# EAGLE design Open Playback Recorder Top (EAGLE 9.6.2)
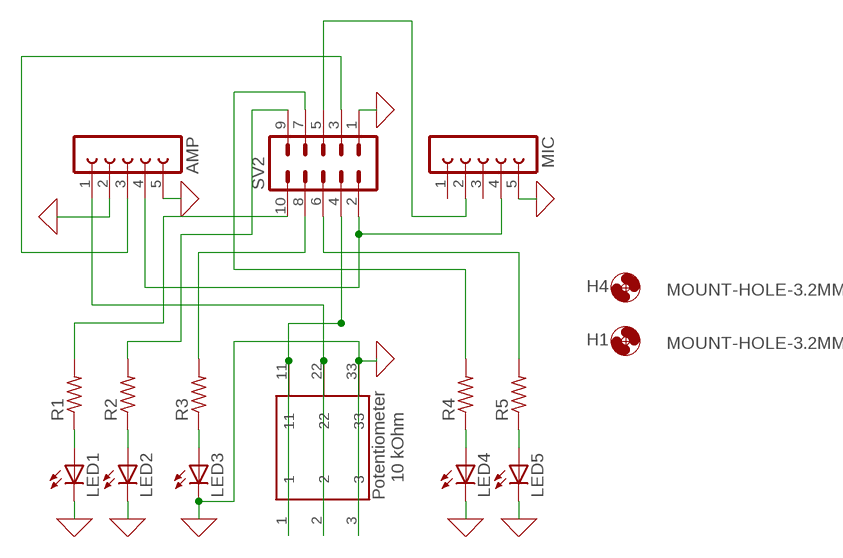
[diagram p0: schematic, sheet 1]

## Parts
AMP  FE05-1  [FE05-1]
H1  MOUNT-HOLE-3.2MM  [HOLE-3.2MM]
H4  MOUNT-HOLE-3.2MM  [HOLE-3.2MM]
LED1  LED5MM  [LED5MM]
LED2  LED5MM  [LED5MM]
LED3  LED5MM  [LED5MM]
LED4  LED5MM  [LED5MM]
LED5  LED5MM  [LED5MM]
MIC  FE05-1  [FE05-1]
R1  RESISTOR-US-0206/80206/8  [RESISTOR_0206/8]
R2  RESISTOR-US-0206/80206/8  [RESISTOR_0206/8]
R3  RESISTOR-US-0206/80206/8  [RESISTOR_0206/8]
R4  RESISTOR-US-0206/80206/8  [RESISTOR_0206/8]
R5  RESISTOR-US-0206/80206/8  [RESISTOR_0206/8]
SV2  MA05-2  [MA05-2]
U$2  POTENTIOMETER  [POTENTIOMETER]

## Nets
GND: AMP.2 AMP.5 LED1.K(C) LED2.K(C) LED3.K(C) LED4.K(C) LED5.K(C) MIC.5 SV2.1 U$2.3 U$2.33
N$1: LED1.A R1.1
N$2: LED2.A R2.1
N$3: LED3.A R3.1
N$4: LED4.A R4.1
N$5: LED5.A R5.1
N$6: SV2.4 U$2.1 U$2.11
N$8: AMP.4 MIC.4 SV2.2
N$9: AMP.1 U$2.2 U$2.22
N$11: R1.2 SV2.10
N$12: R2.2 SV2.9
N$13: R3.2 SV2.8
N$14: R4.2 SV2.7
N$16: R5.2 SV2.6
N$17: MIC.2 SV2.5
N$18: AMP.3 SV2.3
Unconnected: MIC.1 MIC.3

## Library data of the parts
AMP MIC = con-lsta:FE05-1: FEMALE HEADER; OC_FARNELL: unknown; OC_NEWARK: unknown
H1 H4 = MMC Eagle:MOUNT-HOLE-: MOUNTING HOLE with drill center marker
LED1-LED5 = adafruit:LED: LED OSRAM: - CHIPLED LG R971, LG N971, LY N971, LG Q971, LY Q971, LO R971, LY R971 LH N974, LH R974 LS Q976, LO Q976, LY Q976 LO Q996 - Hyper CHIPLED LW Q18S LB Q993, LB Q99A, LB R99A - SideLED LS A670, LO A670, LY A670, LG A670, LP A670 LB A673, LV A673, LT A673, LW A673 LH A674 LY A675 LS A676, LA A676, LO A676, LY A676, LW A676 LS A679, LY A679, LG A679 - Hyper Micro SIDELED® LS Y876, LA Y876, LO Y876, LY Y876 LT Y87S - SmartLED LW L88C, LW L88S LB L89C, LB L89S, LG L890 LS L89K, LO L89K, LY L89K LS L896, LA L896, LO L896, LY L896 - TOPLED LS T670, LO T670, LY T670, LG T670, LP T670 LSG T670, LSP T670, LSY T670, LOP T670, LYG T670 LG T671, LOG T671, LSG T671 LB T673, LV T673, LT T673, LW T673 LH T674 LS T676, LA T676, LO T676, LY T676, LB T676, LH T676, LSB T676, LW T676 LB T67C, LV T67C, LT T67C, LS T67K, LO T67K, LY T67K, LW E67C LS E67B, LA E67B, LO E67B, LY E67B, LB E67C, LV E67C, LT E67C LW T67C LS T679, LY T679, LG T679 LS T770, LO T770, LY T770, LG T770, LP T770 LB T773, LV T773, LT T773, LW T773 LH T774 LS E675, LA E675, LY E675, LS T675 LS T776, LA T776, LO T776, LY T776, LB T776 LHGB T686 LT T68C, LB T68C - Hyper Mini TOPLED® LB M676 - Mini TOPLED Santana® LG M470 LS M47K, LO M47K, LY M47K Source: http://www.osram.convergy.de/
R1-R5 = MMC_Eagle:RESISTOR-US-: RESISTOR, American symbol
SV2 = con-lstb:MA05-2: PIN HEADER; OC_FARNELL: unknown; OC_NEWARK: unknown
U$2 = OPR:POTENTIOMETER

## Board
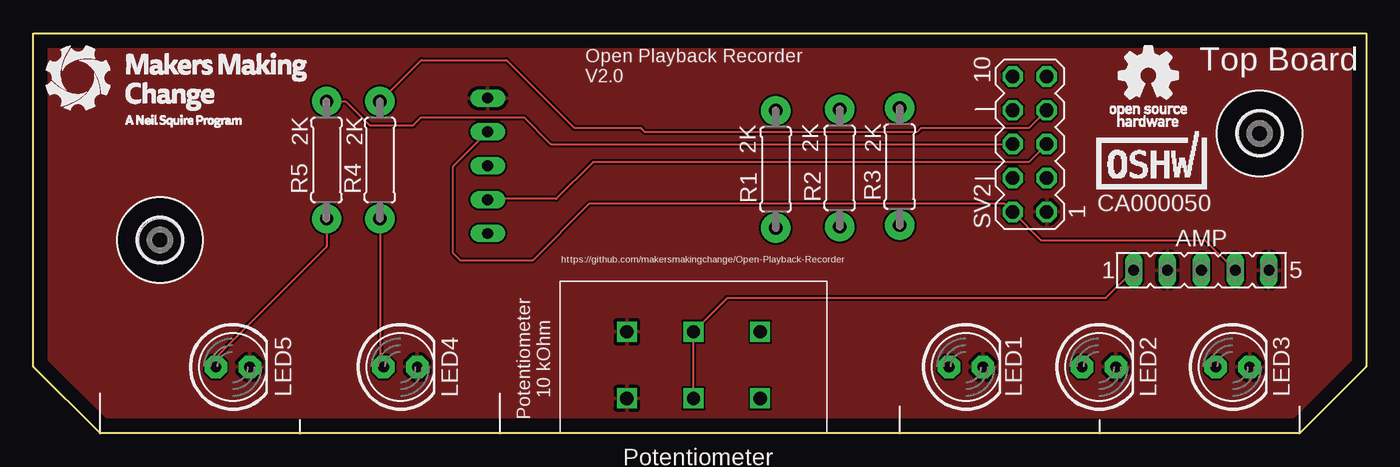
[diagram p1: board, top side]
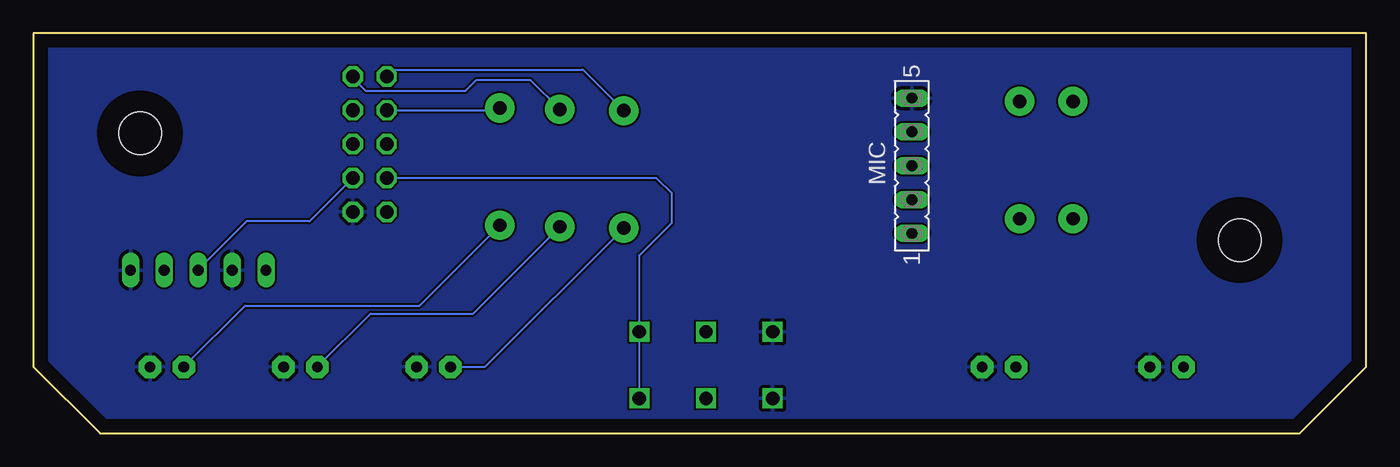
[diagram p2: board, bottom side, seen from below]

Size 100 x 30 mm. Coordinates in mm from the lower left corner, seen from the top.
Outline: 5,0 0,5 0,30 100,30 100,5 95,0 5,0
Copper layers (1*16): Top 0.035mm / dielectric 1.5mm / Bottom 0.035mm
Design rules "default": minimum track width 6mil, minimum drill 0.35mm, track to track 6mil, track to pad 6mil, pad to pad 6mil, via to via 6mil, smd to smd 6mil, copper to edge 40mil, drill to drill 6mil, minimum pad ring 10mil, minimum via ring 8mil, stop-mask expansion 4mil, vias tented up to drill 0mil, thermal gap 10mil

### Footprints (pad centres in the part's own frame; a part is rotated, then mirrored left to right if it is on the bottom)
FE05-1 = drill 0.813 long: 1 -5.08,0; 2 -2.54,0; 3 0,0; 4 2.54,0; 5 5.08,0
HOLE-3.2MM = hole 3.2: 0,0
LED5MM = drill 0.813 pad 1.676 octagon: A -1.27,0; K 1.27,0
RESISTOR_0206/8 = drill 1 pad 2.184: 1 -4.4,0; 2 4.4,0
MA05-2 = drill 1.016 octagon: 1 -5.08,-1.27; 2 -5.08,1.27; 3 -2.54,-1.27; 4 -2.54,1.27; 5 0,-1.27; 6 0,1.27; 7 2.54,-1.27; 8 2.54,1.27; 9 5.08,-1.27; 10 5.08,1.27
POTENTIOMETER = drill 1 square: 1 0,10; 2 0,5; 3 0,0; 11 5,10; 22 5,5; 33 5,0

### Placement (x,y rotation side)
AMP  87.63,12.24 0 top
H1  92,22.5 0 top
H4  9.5,14.5 0 top
LED1  69.97,4.98 0 top
LED2  79.96,4.98 0 top
LED3  89.98,4.98 0 top
LED4  27.54,4.98 0 top
LED5  14.97,4.98 0 top
MIC  34.09,20.07 90 bottom
R1  55.7,19.8 90 top
R2  60.5,19.9 90 top
R3  65,20 90 top
R4  26,20.5 90 top
R5  22,20.5 90 top
SV2  74.76,21.69 90 top
U$1  [MMC_SMALL_LOGO]  12,26 0 top
U$2  44.53,7.62 270 top
U$3  [OSHW_X-SMALL_LOGO]  83.6,26 0 top
U$4  CA000050  [OSHWA-CERT-SMALL-SILK]  83.9,18.3 0 top

### Tracks (layer width: path | path; a pad name or v marks a point on that pad's centre or on a via)
GND
  pour Bottom: 0,30 0,5 5,0 95,0 100,5 100,30
  pour Top: 0,30 0,5 5,0 95,0 100,5 100,30
  pour Top: 95,0 5,0 0,5 0,30 100,30 100,5
  pour Bottom: 5,0 0,5 0,30 100,30 100,5 95,0
N$1
  Bottom 0.152: LED1.A 66.12,4.98 R1.1
N$2
  Bottom 0.152: LED2.A 74.69,8.98 67.02,8.98 R2.1
N$3
  Bottom 0.152: R3.1 71.02,9.58 84.11,9.58 LED3.A
N$4
  Top 0.152: R4.1 26,5.25 LED4.A
N$5
  Top 0.152: R5.1 22,14 13.7,5.7 LED5.A
N$6
  Bottom 0.152: U$2.11 U$2.1 54.53,13.37 52.1,15.8 52.1,18 53.25,19.15 SV2.4
N$8
  Top 0.152: AMP.4 87.91,14.5 75.6,14.5 SV2.2 72.89,17.21 41.71,17.21 37.5,13 32,13 31.5,13.5 31.5,20.02 MIC.4
N$9
  Top 0.152: U$2.22 U$2.2 52.07,10.16 80.47,10.16 AMP.1
N$11
  Bottom 0.152: SV2.10 72.99,27.27 58.77,27.27 R1.2
N$12
  Bottom 0.152: SV2.9 76.03,26.67 75.03,25.67 67.6,25.67 66.77,26.5 62.7,26.5 R2.2
N$13
  Bottom 0.152: SV2.8 65.17,24.23 R3.2
N$14
  Top 0.152: R4.2 29.1,28 35.5,28 40.6,22.9 45.6,22.9 45.9,22.6 66.3,22.6 66.6,22.9 74.7,22.9 SV2.7
N$16
  Top 0.152: R5.2 23.43,24.9 25.23,23.1 28.5,23.1 29.1,23.7 36.8,23.7 38.81,21.69 SV2.6
N$17
  Top 0.152: SV2.5 74.68,20.34 41.98,20.34 39.22,17.58 34.14,17.58 MIC.2
N$18
  Bottom 0.152: SV2.3 79.28,15.9 84,15.9 87.63,12.27 AMP.3

### Text on the board
tPlace: Top Board | Open Playback Recorder / V2.0 | 2K | 2K | 2K | 2K | 2K | https://github.com/makersmakingchange/Open-Playback-Recorder | Potentiometer / 10 kOhm